# Altium schematic sheet MCU.SchDoc
size A4
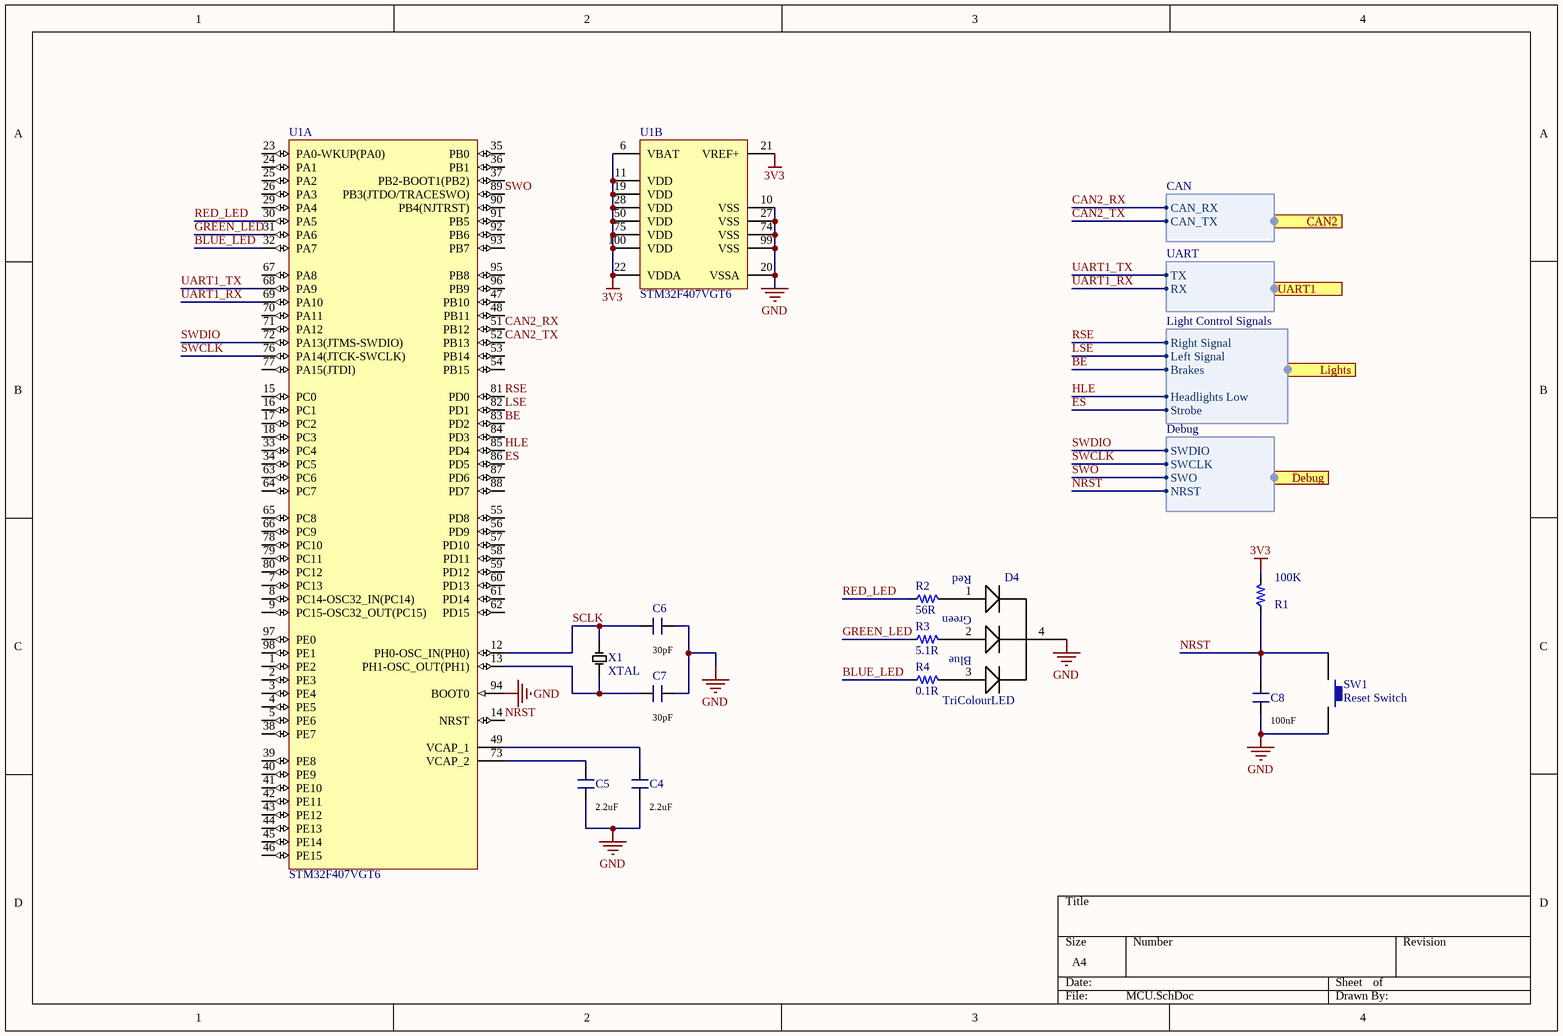
[diagram p0: MCU.SchDoc]

## Parts
C4  Capacitance: 2.2uF  [PCB_GENERIC_SMD_0603]  (hidden comment: SCH_GENERIC_CAPACITOR_0603)
C5  Capacitance: 2.2uF  [PCB_GENERIC_SMD_0603]  (hidden comment: SCH_GENERIC_CAPACITOR_0603)
C6  Capacitance: 30pF  [PCB_GENERIC_SMD_0603]  (hidden comment: SCH_GENERIC_CAPACITOR_0603)
C7  Capacitance: 30pF  [PCB_GENERIC_SMD_0603]  (hidden comment: SCH_GENERIC_CAPACITOR_0603)
C8  Capacitance: 100nF  [PCB_GENERIC_SMD_0603]  (hidden comment: SCH_GENERIC_CAPACITOR_0603)
D4  TriColourLED  [TricolourLED - SunLED - DK  1497-1225-2-ND]
R1  Resistance: 100K  [PCB_GENERIC_SMD_0603]  (hidden comment: SCH_GENERIC_RESISTOR_0603)
R2  Resistance: 56R  [PCB_GENERIC_SMD_0603]  (hidden comment: SCH_GENERIC_RESISTOR_0603)
R3  Resistance: 5.1R  [PCB_GENERIC_SMD_0603]  (hidden comment: SCH_GENERIC_RESISTOR_0603)
R4  Resistance: 0.1R  [PCB_GENERIC_SMD_0603]  (hidden comment: SCH_GENERIC_RESISTOR_0603)
SW1  Reset Switch  [Push Button Switch]
U1  STM32F407VGT6  [STM-LQFP100_M]  (parts A,B of 2)
X1  XTAL  [CRYSTAL_8MHZ]

## Ports
CAN2 (harness CAN), Debug (harness Debug), Lights (harness Light Control Signals), UART1 (harness UART)

## Harnesses
Debug: SWDIO, SWCLK, SWO, NRST
CAN: CAN_RX, CAN_TX
UART: TX, RX
Light Control Signals: Right Signal, Left Signal, Brakes, Headlights Low, Strobe

## Nets
3V3: R1.2 U1.6(VBAT) U1.11(VDD) U1.19(VDD) U1.21(VREF+) U1.22(VDDA) U1.28(VDD) U1.50(VDD) U1.75(VDD) U1.100(VDD)
GND: C4.1 C5.1 C6.1 C7.1 C8.2 D4.4 SW1.2 U1.10(VSS) U1.20(VSSA) U1.27(VSS) U1.74(VSS) U1.94(BOOT0) U1.99(VSS)
BE: U1.83(PD2) ; port Lights.Brakes
BLUE_LED: R4.1 U1.32(PA7)
CAN2_RX: U1.51(PB12) ; port CAN2.CAN_RX
CAN2_TX: U1.52(PB13) ; port CAN2.CAN_TX
ES: U1.86(PD5) ; port Lights.Strobe
GREEN_LED: R3.1 U1.31(PA6)
HLE: U1.85(PD4) ; port Lights.Headlights Low
LSE: U1.82(PD1) ; port Lights.Left Signal
NRST: C8.1 R1.1 SW1.1 U1.14(NRST) ; port Debug.NRST
RED_LED: R2.1 U1.30(PA5)
RSE: U1.81(PD0) ; port Lights.Right Signal
SCLK: C6.2 U1.12(PH0-OSC_IN(PH0)) X1.1
SWCLK: U1.76(PA14(JTCK-SWCLK)) ; port Debug.SWCLK
SWDIO: U1.72(PA13(JTMS-SWDIO)) ; port Debug.SWDIO
SWO: U1.89(PB3(JTDO/TRACESWO)) ; port Debug.SWO
UART1_RX: U1.69(PA10) ; port UART1.RX
UART1_TX: U1.68(PA9) ; port UART1.TX
NetC4_2: C4.2 U1.49(VCAP_1)
NetC5_2: C5.2 U1.73(VCAP_2)
NetC7_2: C7.2 U1.13(PH1-OSC_OUT(PH1)) X1.2
NetD4_1: D4.1(Red) R2.2
NetD4_2: D4.2(Green) R3.2
NetD4_3: D4.3(Blue) R4.2

Not connected (* = marked no-connect by the designer): U1 1(PE2) 2(PE3) 3(PE4) 4(PE5) 5(PE6) 7(PC13) 8(PC14-OSC32_IN(PC14)) 9(PC15-OSC32_OUT(PC15)) 15(PC0) 16(PC1) 17(PC2) 18(PC3) 23(PA0-WKUP(PA0)) 24(PA1) 25(PA2) 26(PA3) 29(PA4) 33(PC4) 34(PC5) 35(PB0) 36(PB1) 37(PB2-BOOT1(PB2)) 38(PE7) 39(PE8) 40(PE9) 41(PE10) 42(PE11) 43(PE12) 44(PE13) 45(PE14) 46(PE15) 47(PB10) 48(PB11) 53(PB14) 54(PB15) 55(PD8) 56(PD9) 57(PD10) 58(PD11) 59(PD12) 60(PD13) 61(PD14) 62(PD15) 63(PC6) 64(PC7) 65(PC8) 66(PC9) 67(PA8) 70(PA11) 71(PA12) 77(PA15(JTDI)) 78(PC10) 79(PC11) 80(PC12) 84(PD3) 87(PD6) 88(PD7) 90(PB4(NJTRST)) 91(PB5) 92(PB6) 93(PB7) 95(PB8) 96(PB9) 97(PE0) 98(PE1)

## Library data of the parts
C4-C8 = SCH_GENERIC_CAPACITOR_0603: Generic SMD capacitor 0603; Tolerance: *%
R1-R4 = SCH_GENERIC_RESISTOR_0603: Generic SMD resistor 0603
SW1 = PushButtonSwitch
U1 = STM32F407VGT6: ARM Cortex-M4 32-bit MCU+FPU, 210 DMIPS, 1024 kB Flash, 192 kB Internal RAM, 82 I/Os, 100-pin LQFP, -40 to 85 degC, Tray; Manufacturer: STMicroelectronics; D/A Converter: 2x12-bit; FLASH Size (Prog) (kB): 1024; I/Os (High Current): 82; Internal RAM Size (kB): 192; Operating Frequency(F) (Processor speed) (MHz): 168; Supply Voltage(Vcc) max (V): 3.6; Supply Voltage(Vcc) min (V): 1.8; DatasheetVersion: Rev. 4; PackageVersion: Rev. 1, 06/2013; PackageReference: LQFP100; PackageDescription: 100-Pin Low Profile Quad Flat Package, 14 x 14 mm Body, 0.5 mm Pitch; Supplier 1: Digi-Key; Supplier Part Number 1: 497-11605-ND; Supplier 2: Farnell; Supplier Part Number 2: 2064368; Supplier 3: Newark; Supplier Part Number 3: 73T2333; Supplier 4: Mouser; Supplier Part Number 4: 511-STM32F407VGT6; Core: ARM Cortex-M4; Packing: Tray; Mounting Technology: Surface Mount; PartNumber: STM32F407VGT6; ComponentLink1Description: Manufacturer URL; ComponentLink1URL: http://www.st.com/web/en/home.html; ComponentLink2Description: Datasheet; ComponentLink2URL: http://www.st.com/st-web-ui/static/active/en/resource/technical/document/datasheet/DM00037051.pdf; ComponentLink3Description: Package Specification; ComponentLink3URL: http://www.st.com/st-web-ui/static/active/en/resource/technical/document/data_brief/DM00071938.pdf
X1 = Crystal: Frequency: 8MHz